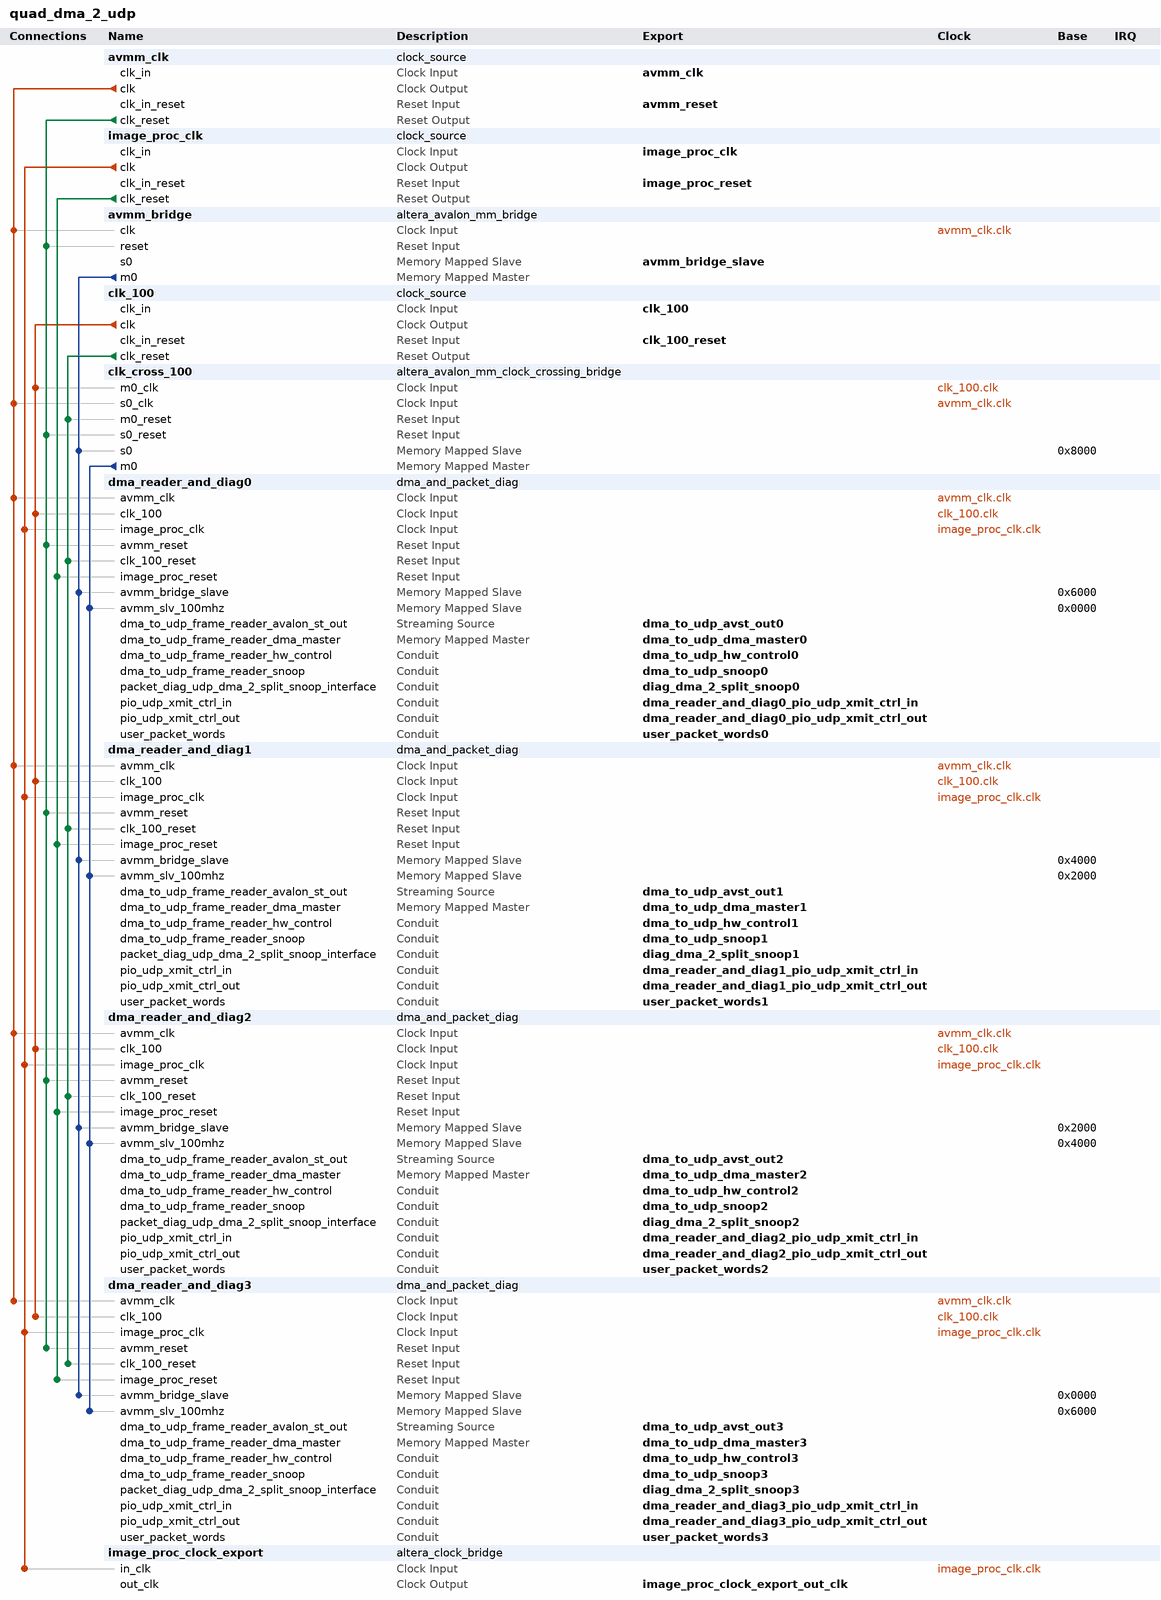
[diagram p0: system contents]
# Platform Designer (Qsys) system quad_dma_2_udp, Arria 10 10AS066H2F34I1SG
# Parameters at their usual value, and those the tool derives, are not listed.
package require -exact qsys 18.1
create_system quad_dma_2_udp
set_project_property DEVICE_FAMILY {Arria 10}
set_project_property DEVICE 10AS066H2F34I1SG

add_instance avmm_clk clock_source 18.1
set_instance_parameter_value avmm_clk clockFrequency 50000000
set_instance_parameter_value avmm_clk resetSynchronousEdges DEASSERT

add_instance image_proc_clk clock_source 18.1
set_instance_parameter_value image_proc_clk clockFrequency 150000000
set_instance_parameter_value image_proc_clk resetSynchronousEdges BOTH

add_instance avmm_bridge altera_avalon_mm_bridge 18.1
set_instance_parameter_value avmm_bridge ADDRESS_UNITS SYMBOLS
set_instance_parameter_value avmm_bridge ADDRESS_WIDTH 10
set_instance_parameter_value avmm_bridge DATA_WIDTH 32
set_instance_parameter_value avmm_bridge MAX_PENDING_RESPONSES 4
set_instance_parameter_value avmm_bridge USE_AUTO_ADDRESS_WIDTH 1

add_instance clk_100 clock_source 18.1
set_instance_parameter_value clk_100 clockFrequency 100000000
set_instance_parameter_value clk_100 resetSynchronousEdges BOTH

add_instance clk_cross_100 altera_avalon_mm_clock_crossing_bridge 18.1
set_instance_parameter_value clk_cross_100 ADDRESS_WIDTH 10
set_instance_parameter_value clk_cross_100 COMMAND_FIFO_DEPTH 4
set_instance_parameter_value clk_cross_100 DATA_WIDTH 32
set_instance_parameter_value clk_cross_100 MASTER_SYNC_DEPTH 2
set_instance_parameter_value clk_cross_100 MAX_BURST_SIZE 1
set_instance_parameter_value clk_cross_100 RESPONSE_FIFO_DEPTH 4
set_instance_parameter_value clk_cross_100 SLAVE_SYNC_DEPTH 2
set_instance_parameter_value clk_cross_100 USE_AUTO_ADDRESS_WIDTH 1

add_instance dma_reader_and_diag0 dma_and_packet_diag 1.0
set_instance_parameter_value dma_reader_and_diag0 address_width 32
set_instance_parameter_value dma_reader_and_diag0 default_valid_packet_length 1024
set_instance_parameter_value dma_reader_and_diag0 dma_enabled_at_startup 0
set_instance_parameter_value dma_reader_and_diag0 num_of_bits_per_pixel 16
set_instance_parameter_value dma_reader_and_diag0 num_of_locations_in_fifo 16
set_instance_parameter_value dma_reader_and_diag0 num_of_pixels_in_frame 100
set_instance_parameter_value dma_reader_and_diag0 num_packet_diag_compared_packets 1
set_instance_parameter_value dma_reader_and_diag0 num_packet_diag_counter_bits 32
set_instance_parameter_value dma_reader_and_diag0 num_watchdog_bits 32
set_instance_parameter_value dma_reader_and_diag0 override_external_swap_buffers_now 0
set_instance_parameter_value dma_reader_and_diag0 override_val_for_external_swap_buffers_now 0
set_instance_parameter_value dma_reader_and_diag0 packet_diag_enable_statistics_gathering 1
set_instance_parameter_value dma_reader_and_diag0 parallelization_ratio 4
set_instance_parameter_value dma_reader_and_diag0 swap_symbol_order_for_dma 0

add_instance dma_reader_and_diag1 dma_and_packet_diag 1.0
set_instance_parameter_value dma_reader_and_diag1 address_width 32
set_instance_parameter_value dma_reader_and_diag1 default_valid_packet_length 1024
set_instance_parameter_value dma_reader_and_diag1 dma_enabled_at_startup 0
set_instance_parameter_value dma_reader_and_diag1 num_of_bits_per_pixel 16
set_instance_parameter_value dma_reader_and_diag1 num_of_locations_in_fifo 16
set_instance_parameter_value dma_reader_and_diag1 num_of_pixels_in_frame 100
set_instance_parameter_value dma_reader_and_diag1 num_packet_diag_compared_packets 1
set_instance_parameter_value dma_reader_and_diag1 num_packet_diag_counter_bits 32
set_instance_parameter_value dma_reader_and_diag1 num_watchdog_bits 32
set_instance_parameter_value dma_reader_and_diag1 override_external_swap_buffers_now 0
set_instance_parameter_value dma_reader_and_diag1 override_val_for_external_swap_buffers_now 0
set_instance_parameter_value dma_reader_and_diag1 packet_diag_enable_statistics_gathering 1
set_instance_parameter_value dma_reader_and_diag1 parallelization_ratio 4
set_instance_parameter_value dma_reader_and_diag1 swap_symbol_order_for_dma 0

add_instance dma_reader_and_diag2 dma_and_packet_diag 1.0
set_instance_parameter_value dma_reader_and_diag2 address_width 32
set_instance_parameter_value dma_reader_and_diag2 default_valid_packet_length 1024
set_instance_parameter_value dma_reader_and_diag2 dma_enabled_at_startup 0
set_instance_parameter_value dma_reader_and_diag2 num_of_bits_per_pixel 16
set_instance_parameter_value dma_reader_and_diag2 num_of_locations_in_fifo 16
set_instance_parameter_value dma_reader_and_diag2 num_of_pixels_in_frame 100
set_instance_parameter_value dma_reader_and_diag2 num_packet_diag_compared_packets 1
set_instance_parameter_value dma_reader_and_diag2 num_packet_diag_counter_bits 32
set_instance_parameter_value dma_reader_and_diag2 num_watchdog_bits 32
set_instance_parameter_value dma_reader_and_diag2 override_external_swap_buffers_now 0
set_instance_parameter_value dma_reader_and_diag2 override_val_for_external_swap_buffers_now 0
set_instance_parameter_value dma_reader_and_diag2 packet_diag_enable_statistics_gathering 1
set_instance_parameter_value dma_reader_and_diag2 parallelization_ratio 4
set_instance_parameter_value dma_reader_and_diag2 swap_symbol_order_for_dma 0

add_instance dma_reader_and_diag3 dma_and_packet_diag 1.0
set_instance_parameter_value dma_reader_and_diag3 address_width 32
set_instance_parameter_value dma_reader_and_diag3 default_valid_packet_length 1024
set_instance_parameter_value dma_reader_and_diag3 dma_enabled_at_startup 0
set_instance_parameter_value dma_reader_and_diag3 num_of_bits_per_pixel 16
set_instance_parameter_value dma_reader_and_diag3 num_of_locations_in_fifo 16
set_instance_parameter_value dma_reader_and_diag3 num_of_pixels_in_frame 100
set_instance_parameter_value dma_reader_and_diag3 num_packet_diag_compared_packets 1
set_instance_parameter_value dma_reader_and_diag3 num_packet_diag_counter_bits 32
set_instance_parameter_value dma_reader_and_diag3 num_watchdog_bits 32
set_instance_parameter_value dma_reader_and_diag3 override_external_swap_buffers_now 0
set_instance_parameter_value dma_reader_and_diag3 override_val_for_external_swap_buffers_now 0
set_instance_parameter_value dma_reader_and_diag3 packet_diag_enable_statistics_gathering 1
set_instance_parameter_value dma_reader_and_diag3 parallelization_ratio 4
set_instance_parameter_value dma_reader_and_diag3 swap_symbol_order_for_dma 0

add_instance image_proc_clock_export altera_clock_bridge 18.1
set_instance_parameter_value image_proc_clock_export DERIVED_CLOCK_RATE 150000000
set_instance_parameter_value image_proc_clock_export EXPLICIT_CLOCK_RATE 0

# connections
add_connection avmm_clk.clk avmm_bridge.clk clock
add_connection avmm_clk.clk clk_cross_100.s0_clk clock
add_connection avmm_clk.clk dma_reader_and_diag0.avmm_clk clock
add_connection avmm_clk.clk dma_reader_and_diag1.avmm_clk clock
add_connection avmm_clk.clk dma_reader_and_diag2.avmm_clk clock
add_connection avmm_clk.clk dma_reader_and_diag3.avmm_clk clock
add_connection clk_100.clk clk_cross_100.m0_clk clock
add_connection clk_100.clk dma_reader_and_diag0.clk_100 clock
add_connection clk_100.clk dma_reader_and_diag1.clk_100 clock
add_connection clk_100.clk dma_reader_and_diag2.clk_100 clock
add_connection clk_100.clk dma_reader_and_diag3.clk_100 clock
add_connection image_proc_clk.clk dma_reader_and_diag0.image_proc_clk clock
add_connection image_proc_clk.clk dma_reader_and_diag1.image_proc_clk clock
add_connection image_proc_clk.clk dma_reader_and_diag2.image_proc_clk clock
add_connection image_proc_clk.clk dma_reader_and_diag3.image_proc_clk clock
add_connection image_proc_clk.clk image_proc_clock_export.in_clk clock
add_connection avmm_clk.clk_reset avmm_bridge.reset reset
add_connection avmm_clk.clk_reset clk_cross_100.s0_reset reset
add_connection avmm_clk.clk_reset dma_reader_and_diag0.avmm_reset reset
add_connection avmm_clk.clk_reset dma_reader_and_diag1.avmm_reset reset
add_connection avmm_clk.clk_reset dma_reader_and_diag2.avmm_reset reset
add_connection avmm_clk.clk_reset dma_reader_and_diag3.avmm_reset reset
add_connection clk_100.clk_reset clk_cross_100.m0_reset reset
add_connection clk_100.clk_reset dma_reader_and_diag0.clk_100_reset reset
add_connection clk_100.clk_reset dma_reader_and_diag1.clk_100_reset reset
add_connection clk_100.clk_reset dma_reader_and_diag2.clk_100_reset reset
add_connection clk_100.clk_reset dma_reader_and_diag3.clk_100_reset reset
add_connection image_proc_clk.clk_reset dma_reader_and_diag0.image_proc_reset reset
add_connection image_proc_clk.clk_reset dma_reader_and_diag1.image_proc_reset reset
add_connection image_proc_clk.clk_reset dma_reader_and_diag2.image_proc_reset reset
add_connection image_proc_clk.clk_reset dma_reader_and_diag3.image_proc_reset reset
add_connection avmm_bridge.m0 clk_cross_100.s0 avalon
set_connection_parameter_value avmm_bridge.m0/clk_cross_100.s0 baseAddress 0x8000
add_connection avmm_bridge.m0 dma_reader_and_diag0.avmm_bridge_slave avalon
set_connection_parameter_value avmm_bridge.m0/dma_reader_and_diag0.avmm_bridge_slave baseAddress 0x6000
add_connection avmm_bridge.m0 dma_reader_and_diag1.avmm_bridge_slave avalon
set_connection_parameter_value avmm_bridge.m0/dma_reader_and_diag1.avmm_bridge_slave baseAddress 0x4000
add_connection avmm_bridge.m0 dma_reader_and_diag2.avmm_bridge_slave avalon
set_connection_parameter_value avmm_bridge.m0/dma_reader_and_diag2.avmm_bridge_slave baseAddress 0x2000
add_connection avmm_bridge.m0 dma_reader_and_diag3.avmm_bridge_slave avalon
set_connection_parameter_value avmm_bridge.m0/dma_reader_and_diag3.avmm_bridge_slave baseAddress 0x0000
add_connection clk_cross_100.m0 dma_reader_and_diag0.avmm_slv_100mhz avalon
set_connection_parameter_value clk_cross_100.m0/dma_reader_and_diag0.avmm_slv_100mhz baseAddress 0x0000
add_connection clk_cross_100.m0 dma_reader_and_diag1.avmm_slv_100mhz avalon
set_connection_parameter_value clk_cross_100.m0/dma_reader_and_diag1.avmm_slv_100mhz baseAddress 0x2000
add_connection clk_cross_100.m0 dma_reader_and_diag2.avmm_slv_100mhz avalon
set_connection_parameter_value clk_cross_100.m0/dma_reader_and_diag2.avmm_slv_100mhz baseAddress 0x4000
add_connection clk_cross_100.m0 dma_reader_and_diag3.avmm_slv_100mhz avalon
set_connection_parameter_value clk_cross_100.m0/dma_reader_and_diag3.avmm_slv_100mhz baseAddress 0x6000

# exported interfaces
add_interface avmm_bridge_slave avalon slave
set_interface_property avmm_bridge_slave EXPORT_OF avmm_bridge.s0
add_interface avmm_clk clock sink
set_interface_property avmm_clk EXPORT_OF avmm_clk.clk_in
add_interface avmm_reset reset sink
set_interface_property avmm_reset EXPORT_OF avmm_clk.clk_in_reset
add_interface clk_100 clock sink
set_interface_property clk_100 EXPORT_OF clk_100.clk_in
add_interface clk_100_reset reset sink
set_interface_property clk_100_reset EXPORT_OF clk_100.clk_in_reset
add_interface diag_dma_2_split_snoop0 conduit end
set_interface_property diag_dma_2_split_snoop0 EXPORT_OF dma_reader_and_diag0.packet_diag_udp_dma_2_split_snoop_interface
add_interface diag_dma_2_split_snoop1 conduit end
set_interface_property diag_dma_2_split_snoop1 EXPORT_OF dma_reader_and_diag1.packet_diag_udp_dma_2_split_snoop_interface
add_interface diag_dma_2_split_snoop2 conduit end
set_interface_property diag_dma_2_split_snoop2 EXPORT_OF dma_reader_and_diag2.packet_diag_udp_dma_2_split_snoop_interface
add_interface diag_dma_2_split_snoop3 conduit end
set_interface_property diag_dma_2_split_snoop3 EXPORT_OF dma_reader_and_diag3.packet_diag_udp_dma_2_split_snoop_interface
add_interface dma_reader_and_diag0_pio_udp_xmit_ctrl_in conduit end
set_interface_property dma_reader_and_diag0_pio_udp_xmit_ctrl_in EXPORT_OF dma_reader_and_diag0.pio_udp_xmit_ctrl_in
add_interface dma_reader_and_diag0_pio_udp_xmit_ctrl_out conduit end
set_interface_property dma_reader_and_diag0_pio_udp_xmit_ctrl_out EXPORT_OF dma_reader_and_diag0.pio_udp_xmit_ctrl_out
add_interface dma_reader_and_diag1_pio_udp_xmit_ctrl_in conduit end
set_interface_property dma_reader_and_diag1_pio_udp_xmit_ctrl_in EXPORT_OF dma_reader_and_diag1.pio_udp_xmit_ctrl_in
add_interface dma_reader_and_diag1_pio_udp_xmit_ctrl_out conduit end
set_interface_property dma_reader_and_diag1_pio_udp_xmit_ctrl_out EXPORT_OF dma_reader_and_diag1.pio_udp_xmit_ctrl_out
add_interface dma_reader_and_diag2_pio_udp_xmit_ctrl_in conduit end
set_interface_property dma_reader_and_diag2_pio_udp_xmit_ctrl_in EXPORT_OF dma_reader_and_diag2.pio_udp_xmit_ctrl_in
add_interface dma_reader_and_diag2_pio_udp_xmit_ctrl_out conduit end
set_interface_property dma_reader_and_diag2_pio_udp_xmit_ctrl_out EXPORT_OF dma_reader_and_diag2.pio_udp_xmit_ctrl_out
add_interface dma_reader_and_diag3_pio_udp_xmit_ctrl_in conduit end
set_interface_property dma_reader_and_diag3_pio_udp_xmit_ctrl_in EXPORT_OF dma_reader_and_diag3.pio_udp_xmit_ctrl_in
add_interface dma_reader_and_diag3_pio_udp_xmit_ctrl_out conduit end
set_interface_property dma_reader_and_diag3_pio_udp_xmit_ctrl_out EXPORT_OF dma_reader_and_diag3.pio_udp_xmit_ctrl_out
add_interface dma_to_udp_avst_out0 avalon_streaming source
set_interface_property dma_to_udp_avst_out0 EXPORT_OF dma_reader_and_diag0.dma_to_udp_frame_reader_avalon_st_out
add_interface dma_to_udp_avst_out1 avalon_streaming source
set_interface_property dma_to_udp_avst_out1 EXPORT_OF dma_reader_and_diag1.dma_to_udp_frame_reader_avalon_st_out
add_interface dma_to_udp_avst_out2 avalon_streaming source
set_interface_property dma_to_udp_avst_out2 EXPORT_OF dma_reader_and_diag2.dma_to_udp_frame_reader_avalon_st_out
add_interface dma_to_udp_avst_out3 avalon_streaming source
set_interface_property dma_to_udp_avst_out3 EXPORT_OF dma_reader_and_diag3.dma_to_udp_frame_reader_avalon_st_out
add_interface dma_to_udp_dma_master0 avalon master
set_interface_property dma_to_udp_dma_master0 EXPORT_OF dma_reader_and_diag0.dma_to_udp_frame_reader_dma_master
add_interface dma_to_udp_dma_master1 avalon master
set_interface_property dma_to_udp_dma_master1 EXPORT_OF dma_reader_and_diag1.dma_to_udp_frame_reader_dma_master
add_interface dma_to_udp_dma_master2 avalon master
set_interface_property dma_to_udp_dma_master2 EXPORT_OF dma_reader_and_diag2.dma_to_udp_frame_reader_dma_master
add_interface dma_to_udp_dma_master3 avalon master
set_interface_property dma_to_udp_dma_master3 EXPORT_OF dma_reader_and_diag3.dma_to_udp_frame_reader_dma_master
add_interface dma_to_udp_hw_control0 conduit end
set_interface_property dma_to_udp_hw_control0 EXPORT_OF dma_reader_and_diag0.dma_to_udp_frame_reader_hw_control
add_interface dma_to_udp_hw_control1 conduit end
set_interface_property dma_to_udp_hw_control1 EXPORT_OF dma_reader_and_diag1.dma_to_udp_frame_reader_hw_control
add_interface dma_to_udp_hw_control2 conduit end
set_interface_property dma_to_udp_hw_control2 EXPORT_OF dma_reader_and_diag2.dma_to_udp_frame_reader_hw_control
add_interface dma_to_udp_hw_control3 conduit end
set_interface_property dma_to_udp_hw_control3 EXPORT_OF dma_reader_and_diag3.dma_to_udp_frame_reader_hw_control
add_interface dma_to_udp_snoop0 conduit end
set_interface_property dma_to_udp_snoop0 EXPORT_OF dma_reader_and_diag0.dma_to_udp_frame_reader_snoop
add_interface dma_to_udp_snoop1 conduit end
set_interface_property dma_to_udp_snoop1 EXPORT_OF dma_reader_and_diag1.dma_to_udp_frame_reader_snoop
add_interface dma_to_udp_snoop2 conduit end
set_interface_property dma_to_udp_snoop2 EXPORT_OF dma_reader_and_diag2.dma_to_udp_frame_reader_snoop
add_interface dma_to_udp_snoop3 conduit end
set_interface_property dma_to_udp_snoop3 EXPORT_OF dma_reader_and_diag3.dma_to_udp_frame_reader_snoop
add_interface image_proc_clk clock sink
set_interface_property image_proc_clk EXPORT_OF image_proc_clk.clk_in
add_interface image_proc_clock_export_out_clk clock source
set_interface_property image_proc_clock_export_out_clk EXPORT_OF image_proc_clock_export.out_clk
add_interface image_proc_reset reset sink
set_interface_property image_proc_reset EXPORT_OF image_proc_clk.clk_in_reset
add_interface user_packet_words0 conduit end
set_interface_property user_packet_words0 EXPORT_OF dma_reader_and_diag0.user_packet_words
add_interface user_packet_words1 conduit end
set_interface_property user_packet_words1 EXPORT_OF dma_reader_and_diag1.user_packet_words
add_interface user_packet_words2 conduit end
set_interface_property user_packet_words2 EXPORT_OF dma_reader_and_diag2.user_packet_words
add_interface user_packet_words3 conduit end
set_interface_property user_packet_words3 EXPORT_OF dma_reader_and_diag3.user_packet_words

set_interconnect_requirement {$system} qsys_mm.clockCrossingAdapter HANDSHAKE
set_interconnect_requirement {$system} qsys_mm.insertDefaultSlave FALSE
set_interconnect_requirement {$system} qsys_mm.maxAdditionalLatency 4

save_system quad_dma_2_udp.qsys
